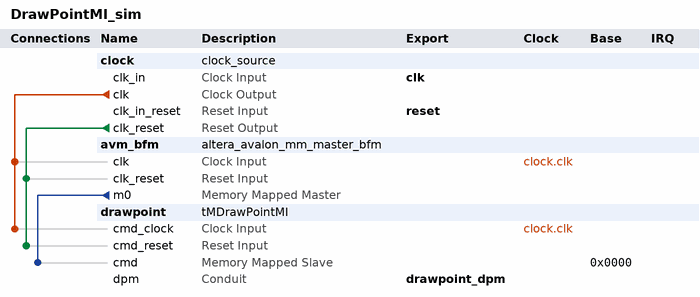
[diagram p0: system contents]
# Platform Designer (Qsys) system DrawPointMI_sim, Cyclone V 5CSEMA5F31C6
# Parameters at their usual value, and those the tool derives, are not listed.
package require -exact qsys 16.0
create_system DrawPointMI_sim
set_project_property DEVICE_FAMILY {Cyclone V}
set_project_property DEVICE 5CSEMA5F31C6

add_instance clock clock_source 16.0
set_instance_parameter_value clock clockFrequency 50000000
set_instance_parameter_value clock resetSynchronousEdges DEASSERT

add_instance avm_bfm altera_avalon_mm_master_bfm 16.0
set_instance_parameter_value avm_bfm ADDRESS_UNITS WORDS
set_instance_parameter_value avm_bfm AV_ADDRESS_W 16
set_instance_parameter_value avm_bfm AV_ALWAYS_BURST_MAX_BURST 0
set_instance_parameter_value avm_bfm AV_BURSTCOUNT_W 10
set_instance_parameter_value avm_bfm AV_BURST_BNDR_ONLY 0
set_instance_parameter_value avm_bfm AV_BURST_LINEWRAP 0
set_instance_parameter_value avm_bfm AV_CONSTANT_BURST_BEHAVIOR 1
set_instance_parameter_value avm_bfm AV_FIX_READ_LATENCY 1
set_instance_parameter_value avm_bfm AV_MAX_PENDING_READS 1
set_instance_parameter_value avm_bfm AV_MAX_PENDING_WRITES 0
set_instance_parameter_value avm_bfm AV_NUMSYMBOLS 2
set_instance_parameter_value avm_bfm AV_READRESPONSE_W 8
set_instance_parameter_value avm_bfm AV_READ_WAIT_TIME 1
set_instance_parameter_value avm_bfm AV_REGISTERINCOMINGSIGNALS 1
set_instance_parameter_value avm_bfm AV_WRITERESPONSE_W 8
set_instance_parameter_value avm_bfm USE_BEGIN_BURST_TRANSFER 1
set_instance_parameter_value avm_bfm USE_BURSTCOUNT 1
set_instance_parameter_value avm_bfm USE_BYTE_ENABLE 1
set_instance_parameter_value avm_bfm USE_READ 1
set_instance_parameter_value avm_bfm USE_READ_DATA 1
set_instance_parameter_value avm_bfm USE_READ_DATA_VALID 1
set_instance_parameter_value avm_bfm USE_WAIT_REQUEST 1
set_instance_parameter_value avm_bfm VHDL_ID 0

add_instance drawpoint tMDrawPointMI 16.0

# connections
add_connection clock.clk avm_bfm.clk clock
add_connection clock.clk drawpoint.cmd_clock clock
add_connection clock.clk_reset avm_bfm.clk_reset reset
add_connection clock.clk_reset drawpoint.cmd_reset reset
add_connection avm_bfm.m0 drawpoint.cmd avalon
set_connection_parameter_value avm_bfm.m0/drawpoint.cmd baseAddress 0x0000

# exported interfaces
add_interface clk clock sink
set_interface_property clk EXPORT_OF clock.clk_in
add_interface drawpoint_dpm conduit end
set_interface_property drawpoint_dpm EXPORT_OF drawpoint.dpm
add_interface reset reset sink
set_interface_property reset EXPORT_OF clock.clk_in_reset

set_interconnect_requirement {$system} qsys_mm.clockCrossingAdapter HANDSHAKE
set_interconnect_requirement {$system} qsys_mm.enableEccProtection FALSE
set_interconnect_requirement {$system} qsys_mm.insertDefaultSlave FALSE
set_interconnect_requirement {$system} qsys_mm.maxAdditionalLatency 1

save_system DrawPointMI_sim.qsys
